# EasyEDA schematic Frozen Slimes v2 MPU.json
TITLE: Sheet_1; REV: 1.0; Date: 2023-01-04; Sheet: 1/1; Company: Your Company
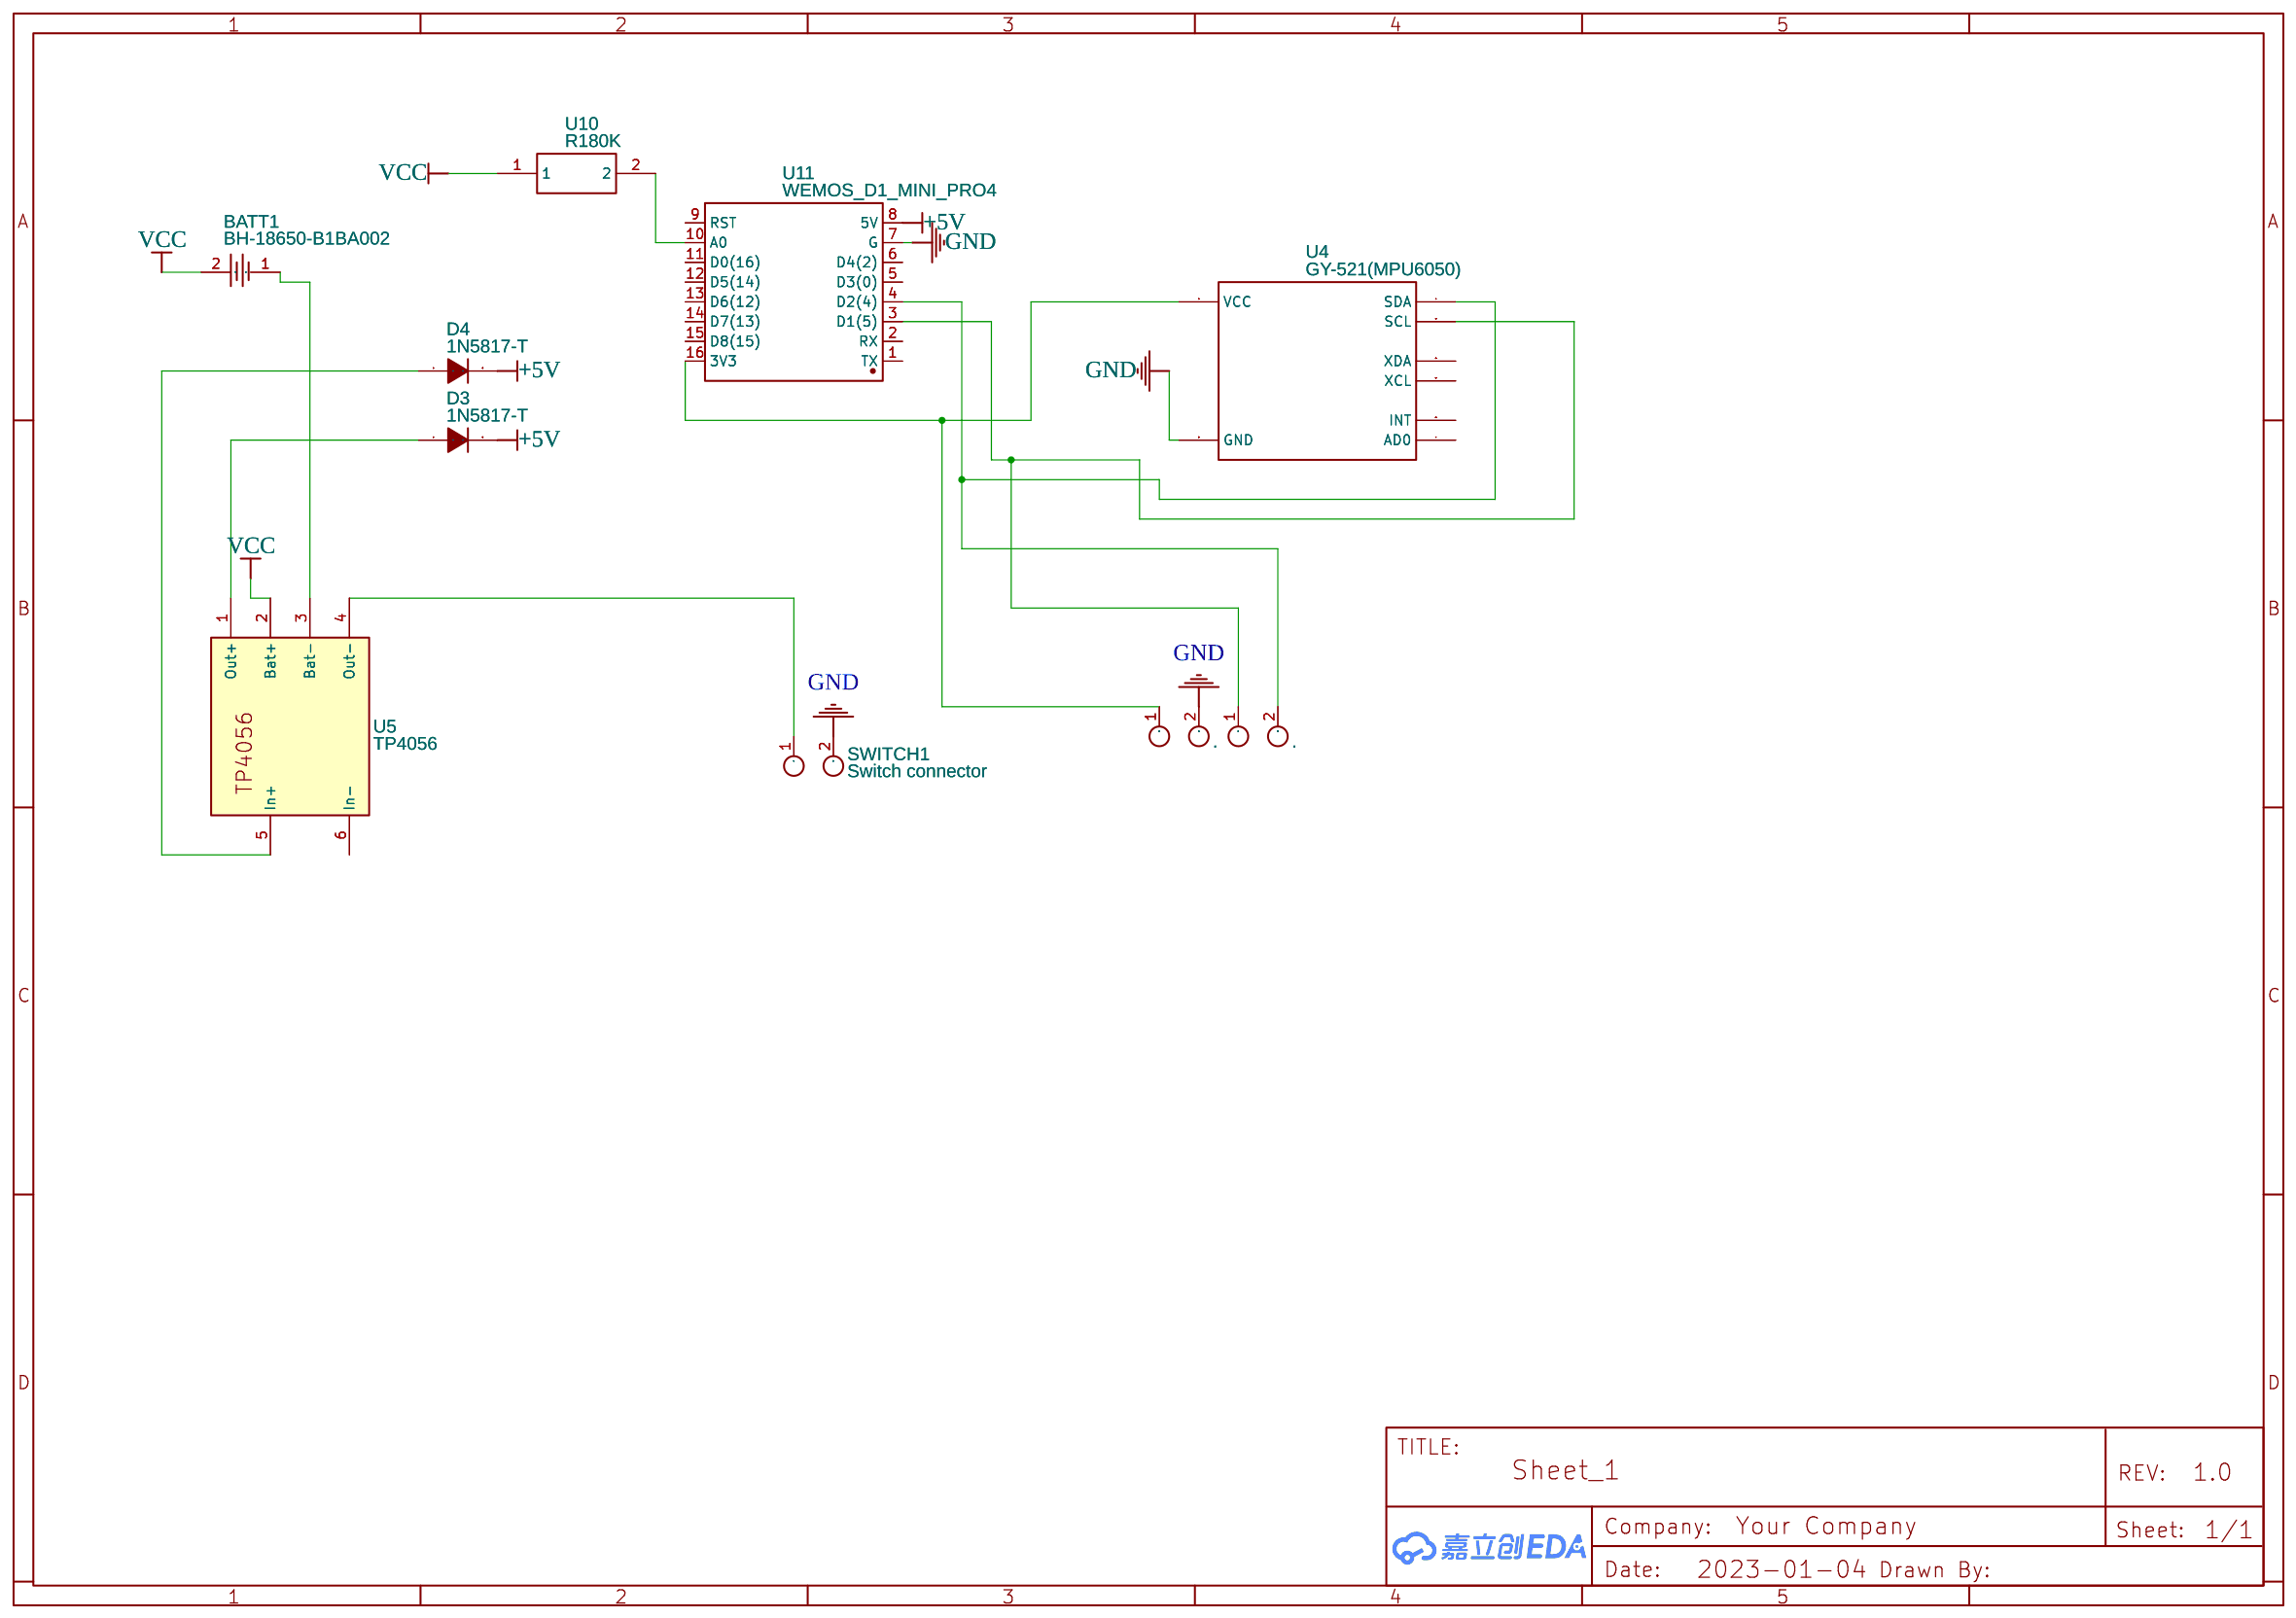
[diagram p0: schematic sheet]

## Parts
BATT1  BH-18650-B1BA002  [BATTERY-SMD_18650-1S-L77.1-W20.7-1]
D3  1N5817-T  [DO-41_BD2.4-L4.7-P8.70-D0.9-FD]
D4  1N5817-T  [DO-41_BD2.4-L4.7-P8.70-D0.9-FD]
SWITCH1  Switch connector  [2XSOLDERPAD]
U4  GY-521(MPU6050)  [PKG-GY-521(MPU6050)]
U5  TP4056  [TP4056]
U8  .  [2XSOLDERPAD]
U9  .  [2XSOLDERPAD]
U10  R180K  [ER RESISTOR 180K/0.6 W]
U11  WEMOS_D1_MINI_PRO4  [DIP-16_WEMOS_D1_MINI_PRO4]

## Library data of the parts
BATT1 = BH-18650-B1BA002: Supplier: LCSC; Supplier Part: C2988620; Manufacturer: MYOUNG(美阳); link: https://atta.szlcsc.com/upload/public/pdf/source/20220402/870DB99AB50CA0DF8D51CF7C86A51FAB.pdf; Contributor: lcsc; JLCPCB Part Class: Extended Part
D3 D4 = 1N5817-T: Supplier: LCSC; Supplier Part: C507852; Manufacturer: DIODES(美台); Contributor: LCSC; JLCPCB Part Class: Extended Part
SWITCH1 U8 U9 = 2XSOLDER PAD: Contributor: matt_2969
U4 = GY-521(MPU6050): Supplier Part: unknow; Manufacturer: SODIAL(R); Manufacturer Part: 014802; link: https://www.invensense.com/wp-content/uploads/2015/02/MPU-6000-Datasheet1.pdf; Contributor: Prof. Ing. F. Scordino
U5 = TP4056: Contributor: defdjamel2008
U10 = R180K: Contributor: Witlon
U11 = WEMOS_D1_MINI_PRO4: Supplier: LCSC; Supplier Part: C2837266; Manufacturer: null; Manufacturer Part: Wemos_D1_mini_Pro4; Contributor: LCSC; JLCPCB Part Class: Extended Part

## Nets
+5V: D3.2(K) D4.2(K) U11.8(5V)
GND: SWITCH1.2 U4.2(GND) U9.2 U11.7(G)
VCC: BATT1.2 U5.2(Bat+) U10.1
Net-(BATT1-1): BATT1.1 U5.3(Bat-)
Net-(D3-1): D3.1(A) U5.1(Out+)
Net-(D4-1): D4.1(A) U5.5(In+)
Net-(SWITCH1-1): SWITCH1.1 U5.4(Out-)
Net-(U4-1): U4.1(VCC) U9.1 U11.16(3V3)
Net-(U4-3): U4.3(SCL) U8.1 U11.3(D1(5))
Net-(U4-4): U4.4(SDA) U8.2 U11.4(D2(4))
Net-(U10-2): U10.2 U11.10(A0)

Not connected (* = marked no-connect by the designer): U4 5(XDA) 6(XCL) 7(AD0) 8(INT); U5 6(In-); U11 1(TX) 2(RX) 5(D3(0)) 6(D4(2)) 9(RST) 11(D0(16)) 12(D5(14)) 13(D6(12)) 14(D7(13)) 15(D8(15))
